# Altium schematic sheet Arduino Connectors.SchDoc: Arduino Connectors
size A4; Project: STM32H7-DK; Date: Not used; ApprovedBy: Not used; CheckedBy: Not used; Author: Not used; CompanyName: STMicroelectronics; DrawnBy: Not used; Engineer: Not used; Organization: Not used; Address1: Not used; Address2: Not used; Address3: Not used; Address4: Not used; DocumentNumber: Not used; Revision: Not used; SheetNumber: 14; SheetTotal: 16; CurrentTime: Not used; CurrentDate: Not used; Time: Not used; DocumentFullPathAndName: Not used; DocumentName: Not used; ModifiedDate: Not used; ImagePath: Not used; ProjectName: Not used; Application_BuildNumber: Not used
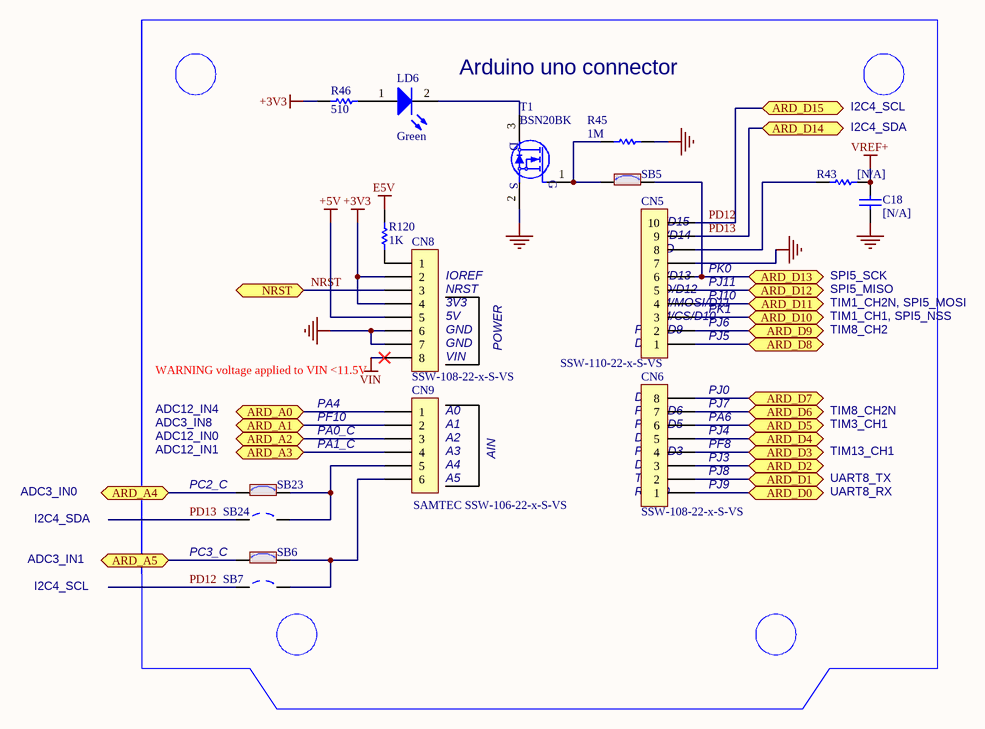
[diagram p0: Arduino Connectors.SchDoc]

## Parts
C18  [N/A]  [0603C]
CN5  SSW-110-22-x-S-VS  [SSW-110-22-X-S-VS]
CN6  SSW-108-22-x-S-VS  [SSW-108-22-X-S-VS]
CN8  SSW-108-22-x-S-VS  [SSW-108-22-X-S-VS]
CN9  SAMTEC SSW-106-22-x-S-VS  [SSW-106-22-X-S-VS]
LD6  Green  [0603D]
R43  [N/A]  [0603R]
R45  1M  [0603R]
R46  510  [0603R]
R120  1K  [0603R]
SB5  Solder Bridge ON  [SB_0603]  (value not drawn)
SB6  Solder Bridge ON  [SB_0603]  (value not drawn)
SB7  Solder Bridge OFF  [SB_0603]  (value not drawn)
SB23  Solder Bridge ON  [SB_0603]  (value not drawn)
SB24  Solder Bridge OFF  [SB_0603]  (value not drawn)
T1  BSN20BK  [SOT-23]

## Ports
ARD_A0 (bidir), ARD_A1 (bidir), ARD_A2 (bidir), ARD_A3 (bidir), ARD_A4 (bidir), ARD_A5 (bidir), ARD_D0 (bidir), ARD_D1 (bidir), ARD_D2 (bidir), ARD_D3 (bidir), ARD_D4 (bidir), ARD_D5 (bidir), ARD_D6 (bidir), ARD_D7 (bidir), ARD_D8 (bidir), ARD_D9 (bidir), ARD_D10 (bidir), ARD_D11 (bidir), ARD_D12 (bidir), ARD_D13 (bidir), ARD_D14 (bidir), ARD_D15 (bidir), NRST (bidir)

## Nets
+3V3: CN8.2 CN8.4 R46.2
+5V: CN8.5
E5V: R120.1
GND: C18.1 CN5.7 CN8.6 CN8.7 R45.2 T1.2(S)
VIN: CN8.8
VREF+: C18.2 R43.2
ARD_A0: CN9.1 ; port ARD_A0
ARD_A1: CN9.2 ; port ARD_A1
ARD_A2: CN9.3 ; port ARD_A2
ARD_A3: CN9.4 ; port ARD_A3
ARD_A4: SB23.1 ; port ARD_A4
ARD_A5: SB6.1 ; port ARD_A5
ARD_D0: CN6.1 ; port ARD_D0
ARD_D1: CN6.2 ; port ARD_D1
ARD_D2: CN6.3 ; port ARD_D2
ARD_D3: CN6.4 ; port ARD_D3
ARD_D4: CN6.5 ; port ARD_D4
ARD_D5: CN6.6 ; port ARD_D5
ARD_D6: CN6.7 ; port ARD_D6
ARD_D7: CN6.8 ; port ARD_D7
ARD_D8: CN5.1 ; port ARD_D8
ARD_D9: CN5.2 ; port ARD_D9
ARD_D10: CN5.3 ; port ARD_D10
ARD_D11: CN5.4 ; port ARD_D11
ARD_D12: CN5.5 ; port ARD_D12
ARD_D13: CN5.6 SB5.2 ; port ARD_D13
NRST: CN8.3 ; port NRST
PD12: CN5.10 SB7.1 ; port ARD_D15
PD13: CN5.9 SB24.1 ; port ARD_D14
NetCN5_8: CN5.8 R43.1
NetCN8_1: CN8.1 R120.2
NetCN9_5: CN9.5 SB23.2 SB24.2
NetCN9_6: CN9.6 SB6.2 SB7.2
NetLD6_1: LD6.1(A) R46.1
NetLD6_2: LD6.2(K) T1.3(D)
NetR45_1: R45.1 SB5.1 T1.1(G)

## Notes on the sheet
- Arduino uno connector
- I2C4_SCL
- I2C4_SDA
- (near CN8) IOREF
- (near CN5) SDA/D14
- SCL/D15
- (near CN5) SCK/D13
- (near CN5) AVDD
- (near CN5) GND
- (near CN5) PK0
- SPI5_SCK
- (near CN8) NRST
- (near CN8) 3V3
- (near CN8) 5V
- (near CN8) GND
- (near CN5) PWM/D9
- (near CN5) PWM/CS/D10
- (near CN5) MISO/D12
- (near CN5) PWM/MOSI/D11
- (near CN5) PJ5
- (near CN5) PJ6
- (near CN5) PK1
- (near CN5) PJ10
- (near CN5) PJ11
- TIM8_CH2
- TIM1_CH1, SPI5_NSS
- TIM1_CH2N, SPI5_MOSI
- SPI5_MISO
- ADC12_IN4
- WARNING voltage applied to VIN <11.5V
- PA4
- (near CN9) A0
- (near CN8) VIN
- POWER
- (near CN6) PWM/D6
- (near CN6) D7
- (near CN5) D8
- (near CN6) PJ7
- PJ0
- TIM8_CH2N
- ADC12_IN1
- ADC12_IN0
- ADC3_IN8
- PF10
- PA0_C
- PA1_C
- (near CN9) A1
- (near CN9) A2
- (near CN9) A3
- (near CN9) A4
- AIN
- (near CN6) D2
- (near CN6) D4
- (near CN6) PWM/D3
- (near CN6) PWM/D5
- (near CN6) PJ8
- (near CN6) PJ3
- (near CN6) PJ4
- (near CN6) PA6
- (near CN6) PF8
- TIM13_CH1
- TIM3_CH1
- ADC3_IN0
- PC2_C
- (near CN9) A5
- (near CN6) RX/D0
- (near CN6) TX/D1
- (near CN6) PJ9
- UART8_RX
- UART8_TX
- ADC3_IN1
- PC3_C
- Title:
- Project:
- Size:
- Revision:
- Variant:
- -
- Date:
- Reference:
- Sheet:
- of

## Library data of the parts
C18 = Cap: Capacitor; Value: 10nF; Ordered by: Subcon; Fitted: NO; ECCN_US/EU: NA; Published: 8-Jun-2000; Revision: July-2002: Re-released for DXP Platform.; Publisher: Altium Limited
CN5 = Header 10X1_Female: Header, 10-Pin, Single row,female; Manuf_1: SAMTEC; Ordered by: Subcon; Silkscreen: pin names as in schematic; LatestRevisionDate: 17-Jul-2002; LatestRevisionNote: Re-released for DXP Platform.; Publisher: Altium Limited; Manuf_Part_1: SSW-110-22-x-S-VS
CN6 CN8 = Header 8X1_Female: Header, 8-Pin, Single row,female; Manuf_1: SAMTEC; Ordered by: Subcon; Silkscreen: pin names as in schematic; LatestRevisionDate: 17-Jul-2002; LatestRevisionNote: Re-released for DXP Platform.; Publisher: Altium Limited; Manuf_Part_1: SSW-108-22-x-S-VS
CN9 = Header 6X1_Female: Header, 6-Pin, Single row,female SMD; Ordered by: Subcon; Silkscreen: pin names as in schematic; LatestRevisionDate: 17-Jul-2002; LatestRevisionNote: Re-released for DXP Platform.; Publisher: Altium Limited; Manuf_1: SAMTEC; Manuf_Part_1: SSW-106-22-x-S-VS
LD6 = LED2: Typical RED, GREEN, YELLOW, AMBER GaAs LED; Ordered by: Subcon; ECCN_US/EU: EAR99/NEC; Published: 8-Jun-2000; Revision: July-2002: Re-released for DXP Platform.; Publisher: Altium Limited
R43 = res1: Resistor; Value: 1K; Ordered by: Subcon; ECCN_US/EU: NA; Fitted: NO; Published: 8-Jun-2000; Revision: July-2002: Re-released for DXP Platform.; Publisher: Altium Limited
R45 = res1: Resistor, 1M , 0603; Ordered by: Subcon; ECCN_US/EU: NA; Published: 8-Jun-2000; Revision: July-2002: Re-released for DXP Platform.; Publisher: Altium Limited; Value: 1M
R46 = Res1: Resistor; Value: 1K; Ordered by: Subcon; ECCN_US/EU: NA; Published: 8-Jun-2000; Revision: July-2002: Re-released for DXP Platform.; Publisher: Altium Limited
R120 = res1: Resistor; Published: 8-Jun-2000; Revision: July-2002: Re-released for DXP Platform.; Publisher: Altium Limited; Value: 1K
SB5 SB6 SB23 = SB_ON: Fitted: YES; Ordered by: Subcon; Revision: July-2002: Re-released for DXP Platform.; ECCN_US/EU: n/a
SB7 SB24 = SB_OFF: Fitted: NO; Ordered by: Subcon; Revision: July-2002: Re-released for DXP Platform.; ECCN_US/EU: n/a
T1 = 2N7000: Manuf_1: NXP; Ordered by: Subcon; Manuf_Part_1: BSN20BK; ECCN_US/EU: N/A